# EAGLE design MovimientoALIM (EAGLE 7.6.0)
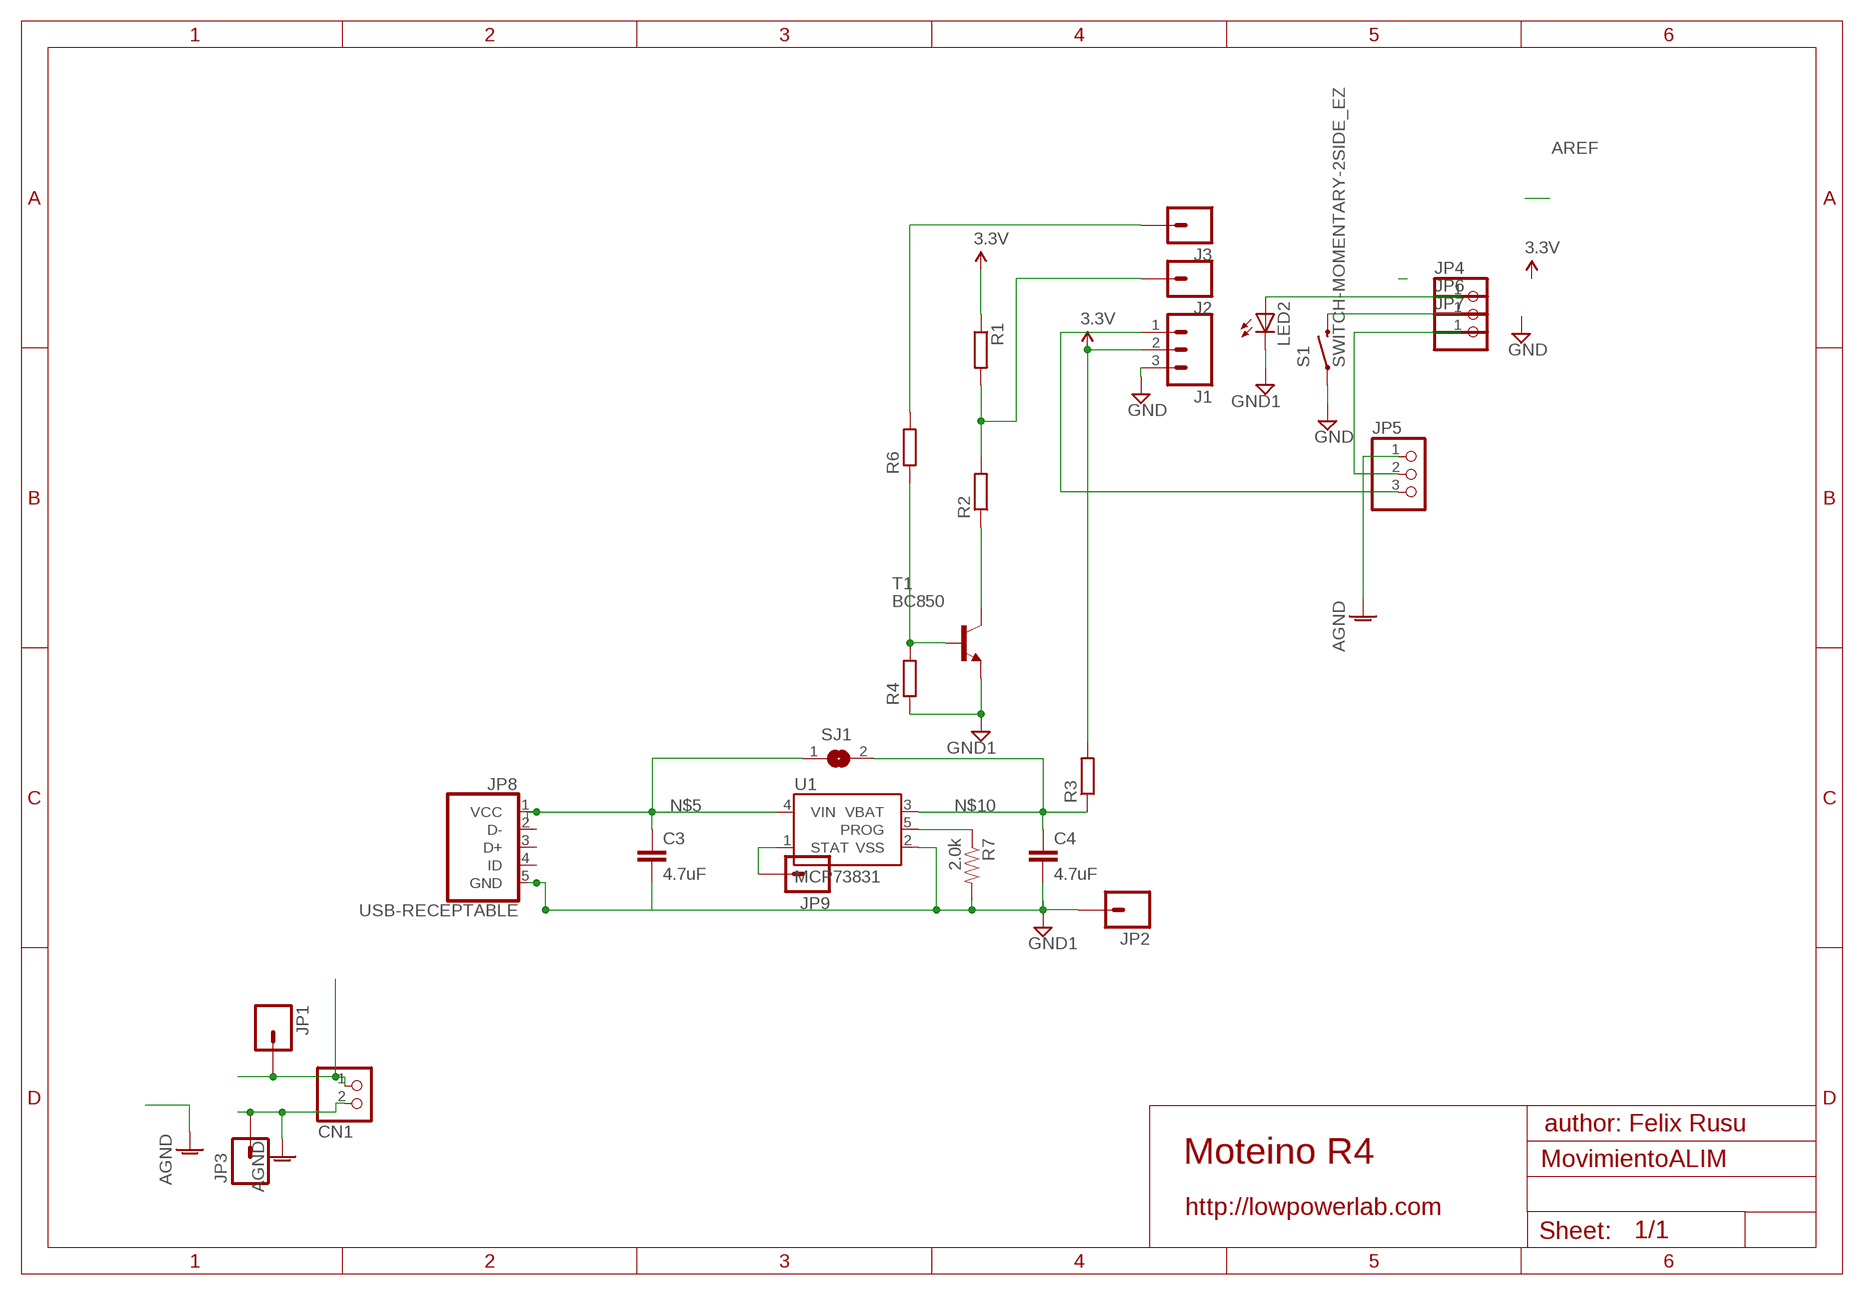
[diagram p0: schematic, sheet 1]

## Parts
C3  4.7uF  4.7UF-6.3V-10%(0603)0603  [0603-CAP]
C4  4.7uF  4.7UF-6.3V-10%(0603)0603  [0603-CAP]
CN1  JST_2PIN-SMT  [JST-PH-2-SMT]
J1  M03PTH  [1X03]
J2  M01PTH  [1X01]
J3  M01PTH  [1X01]
JP1  M01PTH  [1X01]
JP2  M01PTH  [1X01]
JP3  M01PTH  [1X01]
JP4  PINHD-1X1  [1X01]
JP5  PINHD-1X3  [1X03]
JP6  PINHD-1X1  [1X01]
JP7  PINHD-1X1  [1X01]
JP8  USB-RECEPTABLE  [FCI-10103594-0001LF]
JP9  M01PTH  [1X01]
LED2  LED3MM  [LED3MM]
R1  R-EU_0204/7  [0204/7]
R2  R-EU_0204/7  [0204/7]
R3  R-EU_M1206  [M1206]
R4  R-EU_M1206  [M1206]
R6  R-EU_M1206  [M1206]
R7  2.0k  2.0KOHM1/10W5%(0603)  [0603-RES]
S1  SWITCH-MOMENTARY-2SIDE_EZ  [TACTILE-PTH-SIDEEZ]
SJ1  SJ  [SJ]
T1  BC850  [SOT23]
U1  MCP73831  [SOT23-5]

## Nets
AGND [power]: CN1.2 JP3.1 JP5.1
GND [power]: J1.3 S1.1
GND1 [power]: C3.2 C4.2 JP2.1 JP8.5(GND) LED2.K(C) R4.1 R7.2 T1.2(E) U1.2(VSS)
N$1: JP6.1 S1.2
N$2: JP5.2 JP7.1
N$3: J3.1 R6.2
N$5: C3.1 JP8.1(VCC) SJ1.1 U1.4(VIN)
N$6: J2.1 R1.2 R2.2
N$7: R2.1 T1.3(C)
N$8: R4.2 R6.1 T1.1(B)
N$9: J1.1 JP5.3
N$10: C4.1 R3.1 SJ1.2 U1.3(VBAT)
N$11: JP4.1 LED2.A
N$12: CN1.1 JP1.1
N$15: JP9.1 U1.1(STAT)
PROG: R7.1 U1.5(PROG)
VCC: J1.2 R1.1 R3.2 ; supply symbol labelled 3.3V
Unconnected: JP8.2(D-) JP8.3(D+) JP8.4(ID)

## Notes on the sheet
- author: Felix Rusu
- Moteino R4
- http://lowpowerlab.com

## Library data of the parts
C3 C4 = SparkFun-Capacitors:4.7UF-6.3V-10%(0603): CAP-08280; PROD_ID: CAP-08280
CN1 = adafruit:JST_2PIN: JST 2-Pin Connectors of various flavors SMT-RA (S2B-PH-SM4) 4UConnector #17311 SMT (B2B-PH-SM4) THM-RA (S2B-PH) THM (B2B-PH)
J1 = SparkFun-Connectors:M03: Header 3 Standard 3-pin 0.1" header. Use with straight break away headers (SKU : PRT-00116), right angle break away headers (PRT-00553), swiss pins (PRT-00743), machine pins (PRT-00117), and female headers (PRT-00115). Molex polarized connector foot print use with SKU : PRT-08232 with associated crimp pins and housings.
J2 J3 JP1-JP3 JP9 = SparkFun-Connectors:M01: Header 1 Standard 1-pin 0.1" header. Use with straight break away headers (SKU : PRT-00116), right angle break away headers (PRT-00553), swiss pins (PRT-00743), machine pins (PRT-00117), and female headers (PRT-00115). SMTSO-256-ET is a "flush mount" nut for a 4-40 screw. The older package used to be too tight, and did not allow it to sit properly thru the drill hit. The latest (0.165DIA) fits nice and snug.
JP4 JP6 JP7 = pinhead:PINHD-1X1: PIN HEADER
JP5 = pinhead:PINHD-1X3: PIN HEADER
JP8 = daspilker:USB-RECEPTABLE: USB Receptable
LED2 = led:LED: LED OSRAM: - CHIPLED LG R971, LG N971, LY N971, LG Q971, LY Q971, LO R971, LY R971 LH N974, LH R974 LS Q976, LO Q976, LY Q976 LO Q996 - Hyper CHIPLED LW Q18S LB Q993, LB Q99A, LB R99A - SideLED LS A670, LO A670, LY A670, LG A670, LP A670 LB A673, LV A673, LT A673, LW A673 LH A674 LY A675 LS A676, LA A676, LO A676, LY A676, LW A676 LS A679, LY A679, LG A679 - Hyper Micro SIDELED® LS Y876, LA Y876, LO Y876, LY Y876 LT Y87S - SmartLED LW L88C, LW L88S LB L89C, LB L89S, LG L890 LS L89K, LO L89K, LY L89K LS L896, LA L896, LO L896, LY L896 - TOPLED LS T670, LO T670, LY T670, LG T670, LP T670 LSG T670, LSP T670, LSY T670, LOP T670, LYG T670 LG T671, LOG T671, LSG T671 LB T673, LV T673, LT T673, LW T673 LH T674 LS T676, LA T676, LO T676, LY T676, LB T676, LH T676, LSB T676, LW T676 LB T67C, LV T67C, LT T67C, LS T67K, LO T67K, LY T67K, LW E67C LS E67B, LA E67B, LO E67B, LY E67B, LB E67C, LV E67C, LT E67C LW T67C LS T679, LY T679, LG T679 LS T770, LO T770, LY T770, LG T770, LP T770 LB T773, LV T773, LT T773, LW T773 LH T774 LS E675, LA E675, LY E675, LS T675 LS T776, LA T776, LO T776, LY T776, LB T776 LHGB T686 LT T68C, LB T68C - Hyper Mini TOPLED® LB M676 - Mini TOPLED Santana® LG M470 LS M47K, LO M47K, LY M47K Source: http://www.osram.convergy.de LUXEON: - LUMILED® LXK2-PW12-R00, LXK2-PW12-S00, LXK2-PW14-U00, LXK2-PW14-V00 LXK2-PM12-R00, LXK2-PM12-S00, LXK2-PM14-U00 LXK2-PE12-Q00, LXK2-PE12-R00, LXK2-PE12-S00, LXK2-PE14-T00, LXK2-PE14-U00 LXK2-PB12-K00, LXK2-PB12-L00, LXK2-PB12-M00, LXK2-PB14-N00, LXK2-PB14-P00, LXK2-PB14-Q00 LXK2-PR12-L00, LXK2-PR12-M00, LXK2-PR14-Q00, LXK2-PR14-R00 LXK2-PD12-Q00, LXK2-PD12-R00, LXK2-PD12-S00 LXK2-PH12-R00, LXK2-PH12-S00 LXK2-PL12-P00, LXK2-PL12-Q00, LXK2-PL12-R00 Source: www.luxeon.com KINGBRIGHT: KA-3528ASYC Source: www.kingbright.com
R1-R4 R6 = rcl:R-EU_: RESISTOR, European symbol
R7 = SparkFun-Resistors:2.0KOHM1/10W5%(0603): RES-08296; PROD_ID: RES-08296
S1 = SparkFun-Electromechanical:SWITCH-MOMENTARY-2: Various NO switches- pushbuttons, reed, etc
SJ1 = jumper:SJ: SMD solder JUMPER
T1 = transistor:BC850: NPN TRANSISTOR
U1 = SparkFun-PowerIC:MCP73831: Miniature single cell, fully integrated Li-Ion, Li-polymer charge management controller http://ww1.microchip.com/downloads/en/DeviceDoc/21984a.pdf IC-09995; PROD_ID: IC-09995

## Net classes
1 power: width 0.381 mm, clearance 0.254 mm

## Board
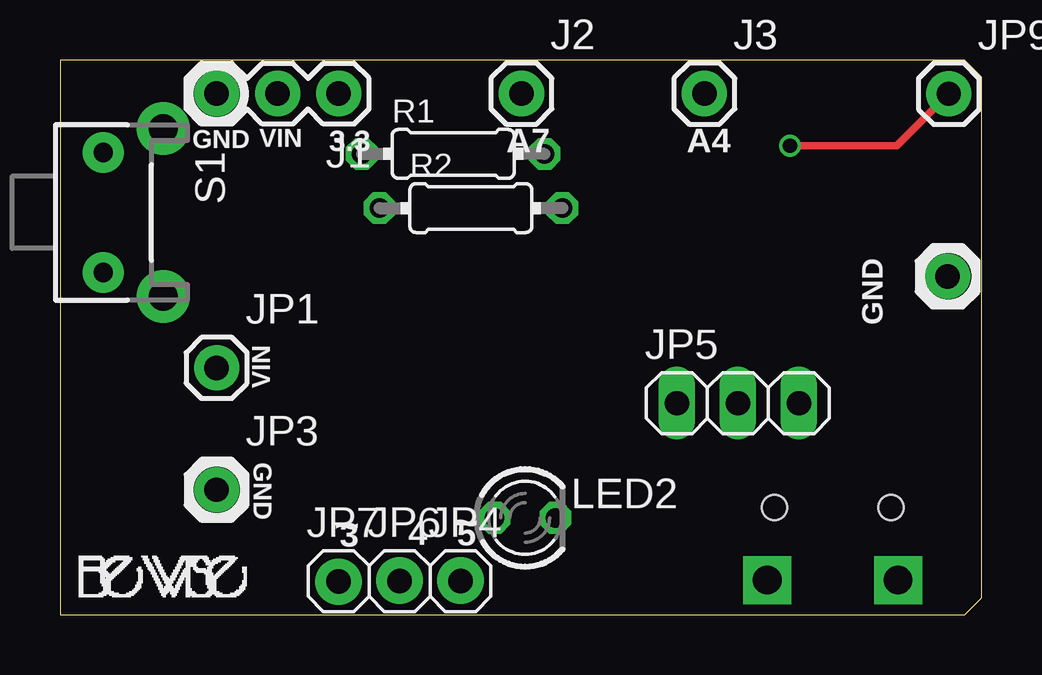
[diagram p1: board, top side]
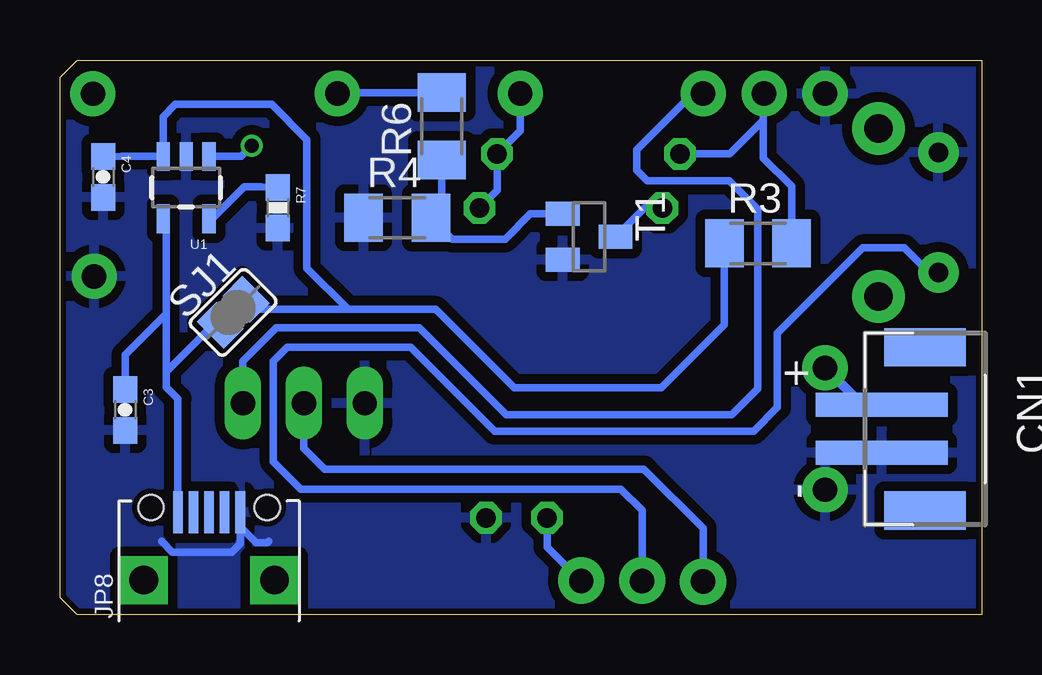
[diagram p2: board, bottom side, seen from below]

Size 38.4 x 23.11 mm. Coordinates in mm from the lower left corner, seen from the top.
Outline: 0,0 37.69,0 38.4,0.71 38.4,22.4 37.69,23.11 0,23.11 0,0
Copper layers (1*16): Top 0.035mm / dielectric 1.5mm / Bottom 0.035mm
Design rules "ITEADstudio_DRC *": minimum track width 6mil, minimum drill 12mil, track to track 16mil, track to pad 12mil, pad to pad 6mil, via to via 6mil, smd to smd 0mil, copper to edge 10mil, drill to drill 10mil, minimum pad ring 10mil, minimum via ring 6mil, stop-mask expansion 2mil, vias tented up to drill 100mil, thermal gap 15mil

### Footprints (pad centres in the part's own frame; a part is rotated, then mirrored left to right if it is on the bottom)
0603-CAP = smd 1.1 x 1: 1 -0.85,0; 2 0.85,0
JST-PH-2-SMT = smd 1 x 5.5: 1 -1,-1.8; 2 1,-1.8 | smd 1.6 x 3.4: NC1 -3.4,0; NC2 3.4,0
1X03 = drill 1.016 pad 1.88: 1 0,0; 2 2.54,0; 3 5.08,0
1X01 = drill 1.016 pad 1.88: 1 0,0
1X01' = drill 1.016 octagon: 1 0,0
1X03' = drill 1.016 long: 1 -2.54,0; 2 0,0; 3 2.54,0
FCI-10103594-0001LF = smd 0.4 x 1.75: 1 -1.3,4.525; 2 -0.65,4.525; 3 0,4.525; 4 0.65,4.525; 5 1.3,4.525 | drill 1.2 pad 2 square: P$3 -2.725,1.7; P$4 2.725,1.7 | hole 1.05: -2.425,4.73; 2.425,4.73
LED3MM = drill 0.813 octagon: A -1.27,0; K 1.27,0
0204/7 = drill 0.813 octagon: 1 -3.81,0; 2 3.81,0
M1206 = smd 1.6 x 2: 1 -1.4,0; 2 1.4,0
0603-RES = smd 1.1 x 1: 1 -0.85,0; 2 0.85,0
TACTILE-PTH-SIDEEZ = drill 0.8 pad 1.7: 1 -2.5,0; 2 2.5,0 | drill 1.2 pad 2.2: ANCHOR1 -3.5,2.5; ANCHOR2 3.5,2.5
SJ = smd 1.168 x 1.6: 1 -0.762,0; 2 0.762,0
SOT23 = smd 1 x 1.4: 1 -0.95,-1.1; 2 0.95,-1.1; 3 0,1.1
SOT23-5 = smd 0.55 x 1.2: 1 -0.95,-1.3; 2 0,-1.3; 3 0.95,-1.3; 4 0.95,1.3; 5 -0.95,1.3

### Placement (x,y rotation side)
C3  35.69,8.53 270 bottom
C4  36.61,18.24 270 bottom
CN1  2.36,7.75 270 bottom
J1  11.61,21.72 180 top
J2  19.23,21.72 0 top
J3  26.85,21.72 0 top
JP1  6.53,10.29 0 top
JP2  36.98,14.1 0 top
JP3  6.53,5.21 0 top
JP4  [1X01']  16.69,1.4 0 top
JP5  [1X03']  28.24,8.81 0 top
JP6  [1X01']  14.15,1.4 0 top
JP7  [1X01']  11.61,1.4 0 top
JP8  32.2,-0.25 0 bottom
JP9  37.03,21.71 0 top
LED2  19.38,4.04 0 top
R1  16.38,19.2 0 top
R2  17.12,16.94 0 top
R3  9.32,15.47 0 bottom
R4  24.35,16.54 0 bottom
R6  22.5,20.35 90 bottom
R7  29.33,16.96 270 bottom
S1  1.8,16.76 270 top
SJ1  31.19,12.6 45 bottom
T1  16.36,15.75 270 bottom
U1  33.15,17.8 180 bottom

### Tracks (layer width: path | path; a pad name or v marks a point on that pad's centre or on a via)
AGND
  pour Bottom: 4.9,22.96 38.3,22.96 38.28,0.15 0.13,0.18 0,22.99
GND
  pour Bottom: -0.03,22.96 38.23,22.96 38.28,0.13 0.15,0.15
GND1
  Bottom 0.305: 34.17,3.06 33.72,2.61 31.24,2.61 30.9,2.96 JP8.5 30.9,3.67 30.22,2.99 29.78,2.99 29.71,3.06
  pour Bottom: 0.1,23.04 38.23,22.96 38.3,0.13 0.18,0.2
N$1  (via drill 1 pad 1.93)
  Bottom 0.305: JP6.1 v14.15,1.42 14.15,4.34 15.04,5.23 28.37,5.23 29.51,6.38 29.51,10.57 28.93,11.15 23.8,11.15 20.29,7.64 9.5,7.64 8.51,8.64 8.51,11.73 4.95,15.29 3.23,15.29 2.2,14.26 S1.2
N$2
  Bottom 0.305: JP7.1 11.61,3.61 14.07,6.07 27.38,6.07 28.24,6.93 JP5.2
N$3
  Bottom 0.305: R6.2 26.81,21.75 J3.1
N$5
  Bottom 0.305: JP8.1 33.5,9 33.98,9.48 33.98,10.12 | 33.98,10.12 33.98,12.54 | 33.98,12.54 33.98,16.37 U1.4 | SJ1.1 32.04,12.06 33.98,10.12 | C3.1 35.69,10.83 33.98,12.54
N$6
  Bottom 0.305: J2.1 19.23,20.17 R1.2 20.19,17.68 R2.2
N$7
  Bottom 0.305: R2.1 14.06,16.94 T1.3
N$8
  Bottom 0.305: T1.1 18.81,16.7 19.86,15.65 22.06,15.65 R4.2 22.5,16.99 R6.1
N$9
  Bottom 0.305: JP5.3 30.78,10.57 29.39,11.96 23.44,11.96 19.81,8.33 10.41,8.33 9.32,9.42 9.32,16.89 10.52,18.09 13.94,18.09 14.38,18.52 14.38,19.38 12.04,21.72 J1.1
N$10
  Bottom 0.305: R3.1 10.72,12.09 13.36,9.45 19.48,9.45 22.76,12.72 26.4,12.72 | 26.4,12.72 30.24,12.72 SJ1.2 | 26.4,12.72 28.12,14.44 28.12,19.8 29.59,21.26 33.6,21.26 34.1,20.76 U1.3 35.84,19.1 C4.1
N$11
  Bottom 0.305: LED2.A 18.11,2.82 JP4.1
N$12
  Bottom 0.406: CN1.1 4.99,8.75 JP1.1
N$13  (via drill 1 pad 1.93)
  other vias: 11.61,1.37
N$14  (via drill 1 pad 1.93)
  other vias: 16.69,1.42
N$15  (via drill 0.6)
  Top 0.305: v30.41,19.54 34.87,19.54 JP9.1
  Bottom 0.305: U1.1 30.86,19.1 v30.41,19.54
PROG
  Bottom 0.305: U1.5 32.06,16.5 30.73,17.82 30.04,17.82 R7.1
VCC
  Bottom 0.305: R3.2 7.92,17.85 9.09,19.02 9.09,20.6 | 9.09,20.6 9.09,21.69 J1.2 | R1.1 10.49,19.2 9.09,20.6

### Text on the board
_tsilk: VIN | 3.3 | A7 | A4 | GND | GND | VIN | GND | 3 | 4 | 5 | ~ | ~